# EAGLE design wm8510-dev-board (EAGLE 6.4)
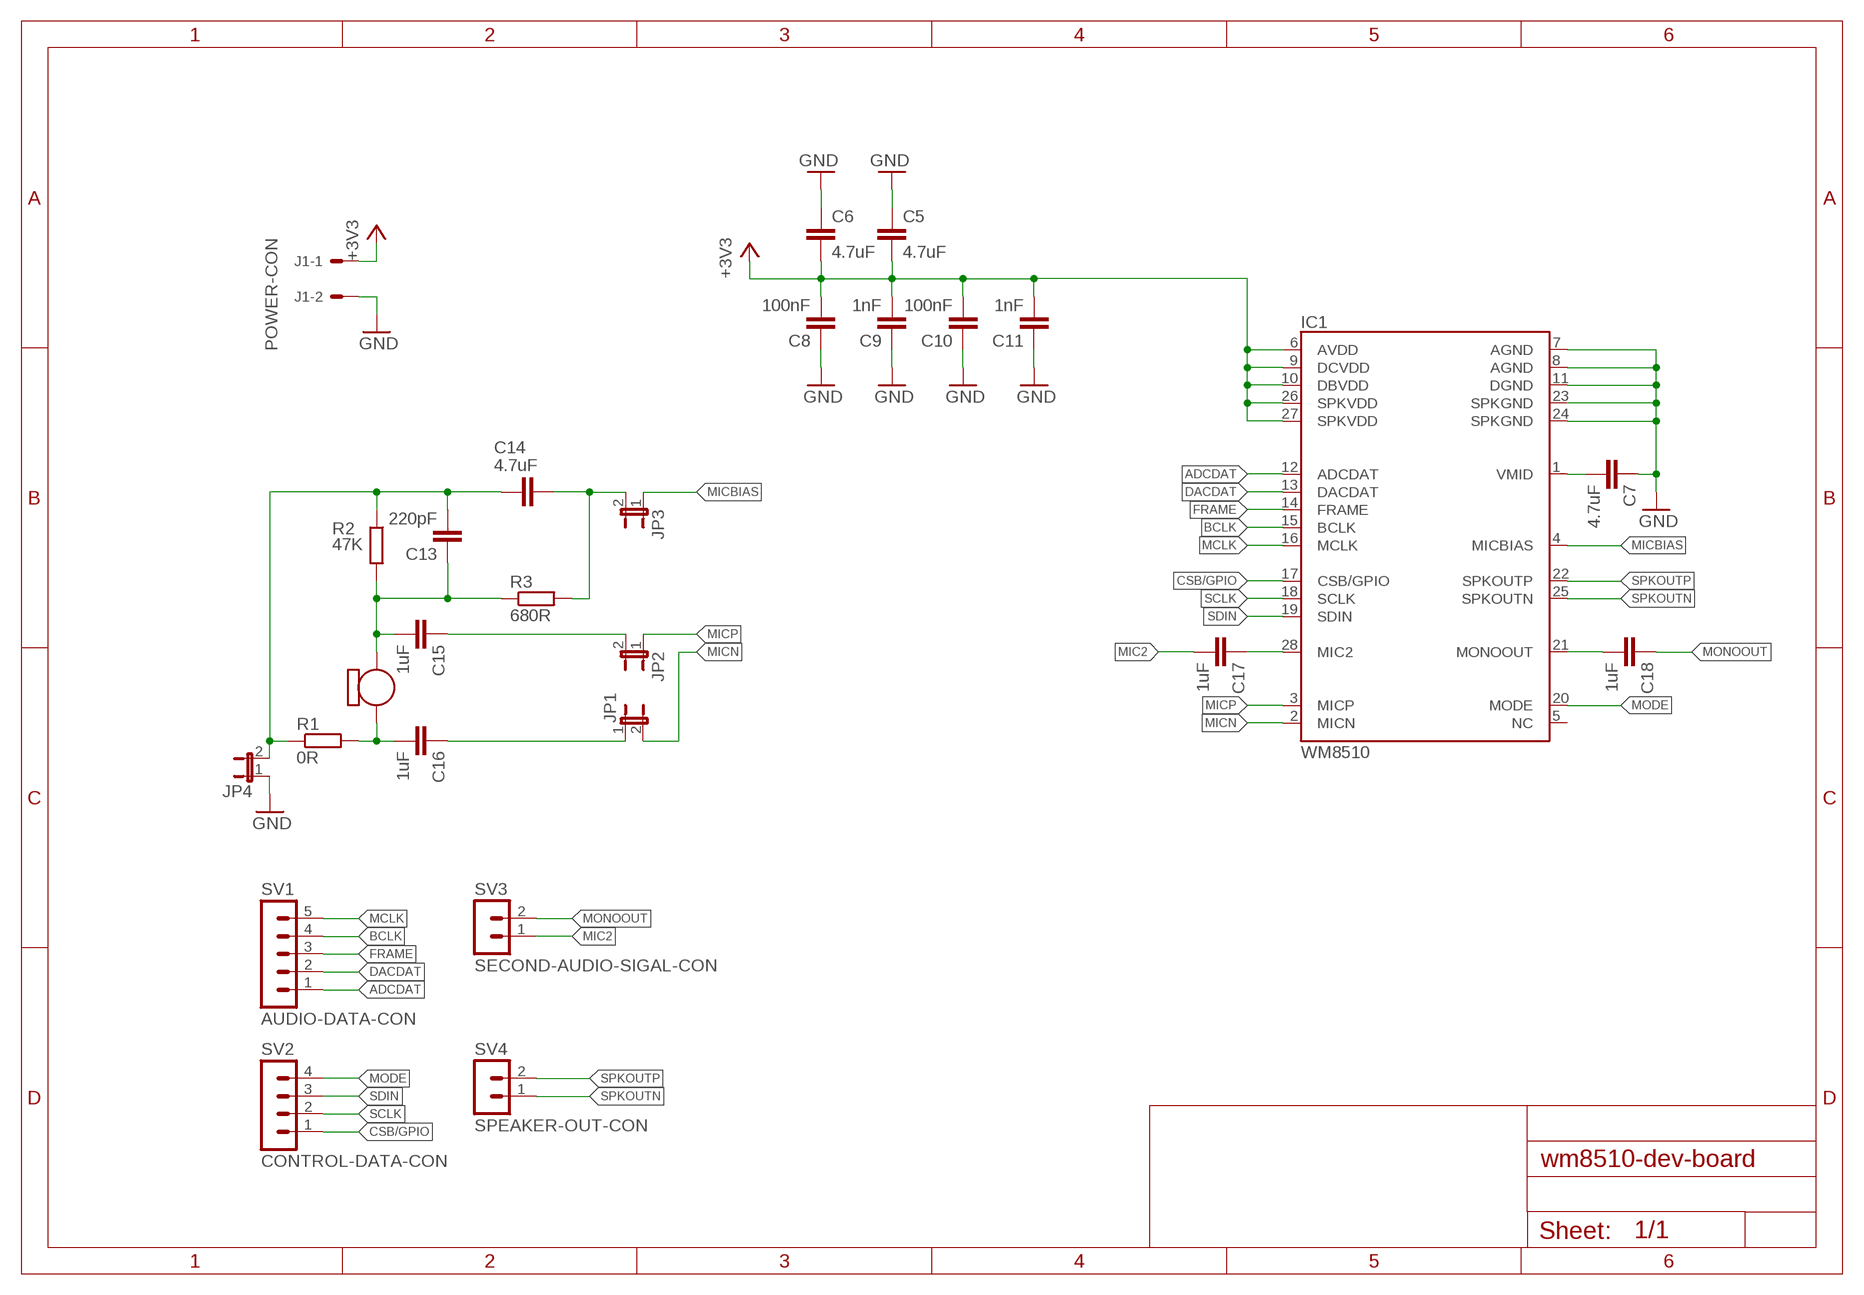
[diagram p0: schematic, sheet 1]

## Parts
C5  4.7uF  C-EUC1206  [C1206]
C6  4.7uF  C-EUC1206  [C1206]
C7  4.7uF  C-EUC1206  [C1206]
C8  100nF  C-EUC1206  [C1206]
C9  1nF  C-EUC1206  [C1206]
C10  100nF  C-EUC1206  [C1206]
C11  1nF  C-EUC1206  [C1206]
C13  220pF  C-EUC1206  [C1206]
C14  4.7uF  C-EUC1206  [C1206]
C15  1uF  C-EUC1206  [C1206]
C16  1uF  C-EUC1206  [C1206]
C17  1uF  C-EUC1206  [C1206]
C18  1uF  C-EUC1206  [C1206]
IC1  WM8510  [SSOP28]
J1  POWER-CON  22-27-2021-02  [6410-02]
JP1  JP1E  [JP1]
JP2  JP1E  [JP1]
JP3  JP1E  [JP1]
JP4  JP1E  [JP1]
R1  0R  R-EU_R1206  [R1206]
R2  47K  R-EU_R1206  [R1206]
R3  680R  R-EU_R1206  [R1206]
SV1  AUDIO-DATA-CON  MA05-1  [MA05-1]
SV2  CONTROL-DATA-CON  MA04-1  [MA04-1]
SV3  SECOND-AUDIO-SIGAL-CON  MA03-1  [MA03-1]
SV4  SPEAKER-OUT-CON  MA03-1  [MA03-1]
U$2  ABM-707-RC  [ABM-707-RC]

## Nets
+3V3: C5.2 C6.2 C8.2 C9.2 C10.2 C11.2 IC1.6(AVDD) IC1.9(DCVDD) IC1.10(DBVDD) IC1.26(SPKVDD) IC1.27(SPKVDD) J1.1
ADCDAT: IC1.12(ADCDAT) SV1.1
BCLK: IC1.15(BCLK) SV1.4
CSB/GPIO: IC1.17(CSB/GPIO) SV2.1
DACDAT: IC1.13(DACDAT) SV1.2
FRAME: IC1.14(FRAME) SV1.3
GND: C5.1 C6.1 C7.1 C8.1 C9.1 C10.1 C11.1 IC1.7(AGND) IC1.8(AGND) IC1.11(DGND) IC1.23(SPKGND) IC1.24(SPKGND) J1.2 JP4.1
MCLK: IC1.16(MCLK) SV1.5
MIC2: C17.2 SV3.1
MICBIAS: IC1.4(MICBIAS) JP3.1
MICN: IC1.2(MICN) JP1.2
MICP: IC1.3(MICP) JP2.1
MODE: IC1.20(MODE) SV2.4
MONOOUT: C18.1 SV3.2
N$1: C7.2 IC1.1(VMID)
N$2: C13.1 C15.2 R2.2 R3.1 U$2.P$1
N$3: C16.2 R1.2 U$2.P$2
N$4: C14.1 JP3.2 R3.2
N$5: C13.2 C14.2 JP4.2 R1.1 R2.1
N$6: C16.1 JP1.1
N$7: C15.1 JP2.2
N$17: C17.1 IC1.28(MIC2)
N$18: C18.2 IC1.21(MONOOUT)
SCLK: IC1.18(SCLK) SV2.2
SDIN: IC1.19(SDIN) SV2.3
SPKOUTN: IC1.25(SPKOUTN) SV4.1
SPKOUTP: IC1.22(SPKOUTP) SV4.2
Unconnected: IC1.5(NC)

## Library data of the parts
C5-C11 C13-C18 = rcl:C-EU: CAPACITOR, European symbol
IC1 = project-specific-library:WM8510; OC_FARNELL: 1776254
J1 = con-molex:22-?-02: CONNECTOR wire to board 2.54 mm (.1 inch) pitch header; OC_FARNELL: unknown; OC_NEWARK: unknown
JP1-JP4 = jumper:JP1E: JUMPER
R1-R3 = rcl:R-EU_: RESISTOR, European symbol
SV1 = con-lstb:MA05-1: PIN HEADER; OC_FARNELL: unknown; OC_NEWARK: unknown
SV2 = con-lstb:MA04-1: PIN HEADER; OC_FARNELL: unknown; OC_NEWARK: unknown
SV3 SV4 = project-specific-library:MA03-1: PIN HEADER; OC_FARNELL: unknown; OC_NEWARK: unknown
U$2 = project-specific-library:ABM-707-RC; OC_FARNELL: 173-6563

## Board
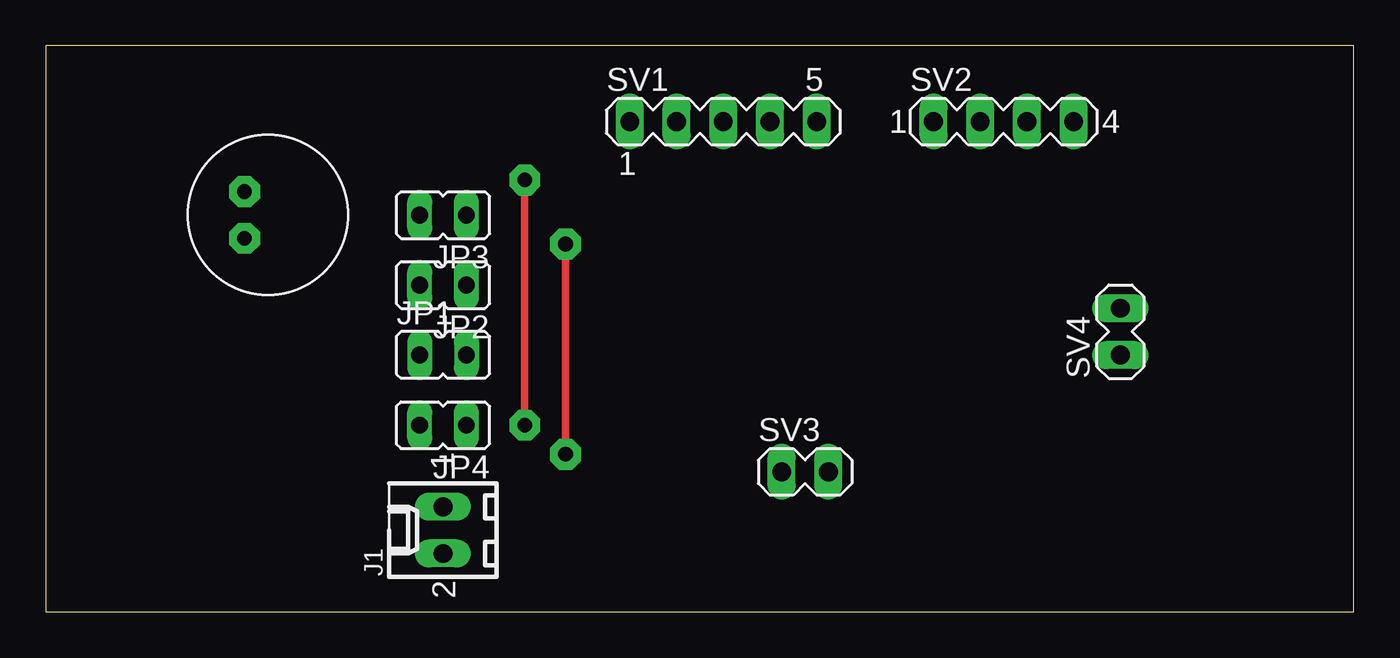
[diagram p1: board, top side]
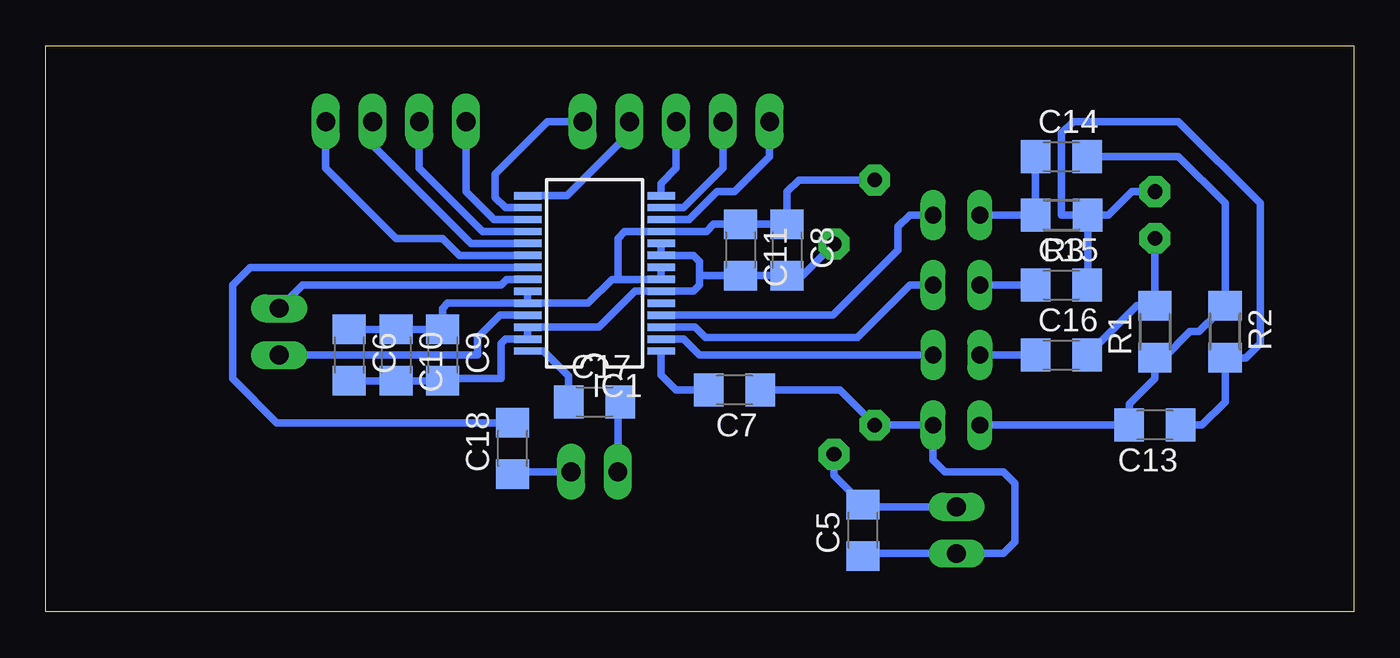
[diagram p2: board, bottom side, seen from below]

Size 71.1 x 30.78 mm. Coordinates in mm from the lower left corner, seen from the top.
Outline: 0,0 71.1,0 71.1,30.78 0,30.78 0,0
Copper layers (1*16): Top 0.035mm / dielectric 1.5mm / Bottom 0.035mm
Design rules "2 vrstvy trida 5": minimum track width 0.2mm, minimum drill 0.4mm, track to track 0.2mm, track to pad 0.2mm, pad to pad 0.2mm, via to via 0.2mm, smd to smd 0.2mm, copper to edge 1mm, drill to drill 0.4mm, minimum pad ring 0.2mm, minimum via ring 0.2mm, stop-mask expansion 0.07mm, vias tented up to drill 3mm, thermal gap 10mil

### Footprints (pad centres in the part's own frame; a part is rotated, then mirrored left to right if it is on the bottom)
C1206 = smd 1.6 x 1.8: 1 -1.4,0; 2 1.4,0
SSOP28 = smd 0.4 x 1.5: 1 -4.225,-3.625; 2 -3.575,-3.625; 3 -2.925,-3.625; 4 -2.275,-3.625; 5 -1.625,-3.625; 6 -0.975,-3.625; 7 -0.325,-3.625; 8 0.325,-3.625; 9 0.975,-3.625; 10 1.625,-3.625; 11 2.275,-3.625; 12 2.925,-3.625; 13 3.575,-3.625; 14 4.225,-3.625; 15 4.225,3.625; 16 3.575,3.625; 17 2.925,3.625; 18 2.275,3.625; 19 1.625,3.625; 20 0.975,3.625; 21 0.325,3.625; 22 -0.325,3.625; 23 -0.975,3.625; 24 -1.625,3.625; 25 -2.275,3.625; 26 -2.925,3.625; 27 -3.575,3.625; 28 -4.225,3.625
6410-02 = drill 1.016 long: 1 1.27,0; 2 -1.27,0
JP1 = drill 0.914 long: 1 0,-1.27; 2 0,1.27
R1206 = smd 1.6 x 1.803: 1 -1.422,0; 2 1.422,0
MA05-1 = drill 1.016 long: 1 -5.08,0; 2 -2.54,0; 3 0,0; 4 2.54,0; 5 5.08,0
MA04-1 = drill 1.016 long: 1 -3.81,0; 2 -1.27,0; 3 1.27,0; 4 3.81,0
MA03-1 = drill 1.016 long: 1 -2.54,0; 2 0,0
ABM-707-RC = drill 0.8 pad 1.676 octagon: P$1 1.27,-1.27; P$2 1.27,1.27

### Placement (x,y rotation side)
C5  26.67,4.45 90 bottom
C6  54.61,13.97 270 bottom
C7  33.66,12.06 180 bottom
C8  30.8,19.69 270 bottom
C9  49.53,13.97 270 bottom
C10  52.07,13.97 270 bottom
C11  33.34,19.69 270 bottom
C13  10.8,10.16 180 bottom
C14  15.88,24.77 0 bottom
C15  15.88,17.78 0 bottom
C16  15.88,13.97 0 bottom
C17  41.27,11.43 0 bottom
C18  45.72,8.89 90 bottom
IC1  41.27,18.41 90 bottom
J1  21.59,4.45 90 top
JP1  21.59,13.97 270 top
JP2  21.59,17.78 90 top
JP3  21.59,21.59 90 top
JP4  21.59,10.16 90 top
R1  10.8,15.24 90 bottom
R2  6.98,15.24 270 bottom
R3  15.88,21.59 180 bottom
SV1  36.83,26.67 0 top
SV2  52.07,26.67 0 top
SV3  42.54,7.62 0 top
SV4  58.42,16.51 90 top
U$2  12.06,21.59 180 top

### Tracks (layer width: path | path; a pad name or v marks a point on that pad's centre or on a via)
+3V3  (via drill 0.8 pad 1.68)
  Top 0.406: v28.26,20 v28.26,8.57
  Bottom 0.406: IC1.10 IC1.9 35.9,19.39 35.56,19.05 35.56,18.41 | 35.56,18.41 35.56,17.78 35.9,17.44 IC1.6 39.07,17.44 41.02,15.49 IC1.26 IC1.27 46.12,14.84 46.35,14.6 46.35,12.7 49.53,12.7 C9.2 C10.2 C6.2 | J1.1 26.54,5.71 C5.2 28.26,7.43 v28.26,8.57 | v28.26,20 29.98,18.28 C8.2 C11.2 35.43,18.28 35.56,18.41
ADCDAT
  Bottom 0.406: IC1.12 36.13,21.34 34.61,22.86 33.66,22.86 31.75,24.77 SV1.1
BCLK
  Bottom 0.406: IC1.15 42.76,22.64 39.37,26.03 SV1.4
CSB/GPIO
  Bottom 0.406: SV2.1 48.26,22.86 46.74,21.34 IC1.17
DACDAT
  Bottom 0.406: IC1.13 36.43,21.99 34.29,24.13 SV1.2
FRAME
  Bottom 0.406: IC1.14 37.65,23.31 36.83,24.13 SV1.3
GND  (via drill 0.8 pad 1.68)
  Top 0.406: v26.04,10.16 v26.04,23.49
  Bottom 0.406: IC1.24 IC1.23 | IC1.8 IC1.7 40.01,18.09 | 40.01,18.09 40.33,18.09 41.63,16.79 IC1.24 | 40.01,18.09 40.01,20.32 39.63,20.69 IC1.11 35.19,20.69 34.8,21.09 C11.1 C8.1 30.8,22.86 30.16,23.49 v26.04,23.49 | C6.1 C10.1 C9.1 49.53,16.51 49.25,16.79 IC1.24 | C5.1 26.54,3.18 J1.2 19.05,3.18 18.41,3.81 18.41,6.98 19.05,7.62 22.23,7.62 22.86,8.26 JP4.1 v26.04,10.16 27.94,12.06 C7.1
MCLK
  Bottom 0.406: IC1.16 46.12,21.99 46.67,22.54 46.67,23.81 43.82,26.67 SV1.5
MIC2
  Bottom 0.406: C17.2 40.01,11.3 SV3.1
MICBIAS
  Bottom 0.406: IC1.4 28.31,16.14 24.77,19.69 24.77,20.95 24.13,21.59 JP3.1
MICN
  Bottom 0.406: IC1.2 36.43,14.84 35.56,13.97 JP1.2
MICP
  Bottom 0.406: IC1.3 35.81,15.49 35.24,14.92 26.99,14.92 24.13,17.78 JP2.1
MODE
  Bottom 0.406: SV2.4 55.88,24.13 52.07,20.32 49.53,20.32 48.6,19.39 IC1.20
MONOOUT
  Bottom 0.406: C18.1 45.59,7.62 SV3.2
N$1
  Bottom 0.406: IC1.1 37.65,12.88 36.83,12.06 C7.2
N$2
  Bottom 0.406: C15.2 14.45,17.8 R3.1 | R3.1 13.34,21.59 12.06,22.86 U$2.P$1 | C13.1 8.26,10.16 6.98,11.43 R2.2 5.87,13.82 5.08,14.6 5.08,22.23 9.52,26.67 15.24,26.67 15.88,26.03 15.88,21.59 R3.1
N$3
  Bottom 0.406: C16.2 11.78,16.66 R1.2 U$2.P$2
N$4
  Bottom 0.406: JP3.2 R3.2 17.3,24.74 C14.1
N$5
  Bottom 0.406: JP4.2 C13.2 12.2,11.3 10.8,12.7 R1.1 10.31,13.82 8.89,15.24 8.41,15.24 7.38,16.27 R2.1 6.98,22.23 9.52,24.77 C14.2
N$6
  Bottom 0.406: C16.1 JP1.1
N$7
  Bottom 0.406: C15.1 JP2.2
N$17
  Bottom 0.406: IC1.28 44.04,14.19 42.68,12.83 C17.1
N$18
  Bottom 0.406: C18.2 58.55,10.29 60.96,12.7 60.96,17.78 60,18.74 IC1.21
SCLK
  Bottom 0.406: SV2.2 50.8,24.13 47.36,20.69 IC1.18
SDIN
  Bottom 0.406: SV2.3 53.34,25.4 47.98,20.04 IC1.19
SPKOUTN
  Bottom 0.406: IC1.25 46.41,16.14 47.63,14.92 47.63,13.97 SV4.1
SPKOUTP
  Bottom 0.406: IC1.22 46.04,18.09 46.35,17.78 57.15,17.78 SV4.2